# Altium schematic sheet Button.SchDoc
size A4; Author: Đỗ Ngọc Quý; Organization: Altium Limited; Address1: L3, 12a Rodborough Rd; Address2: Frenchs Forest; Address3: NSW; Address4: Australia 2086
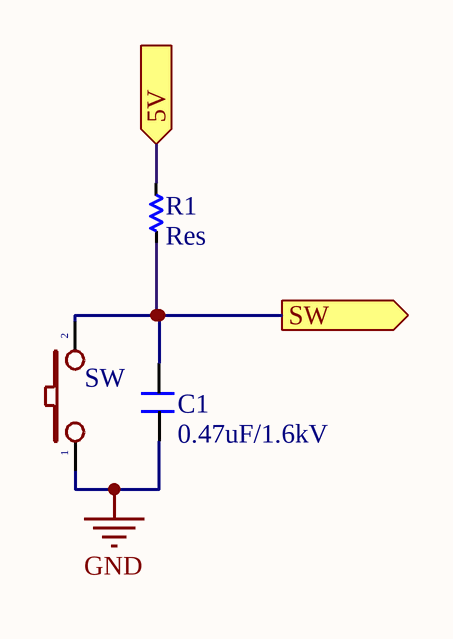
[diagram p0: Button.SchDoc]

## Parts
C1  0.47uF/1.6kV  [cap 0805]
R1  Res  [RES-SMD-0101]
  SW  [SW-SMD_apes]

## Ports
5V (in), SW (out)

## Nets
GND: C1.1 .1
5V: R1.1 ; port 5V
SW: C1.2 R1.2 .2 ; port SW

## Notes on the sheet
- Title
- Size:
- Date:
- A4
- Number:
- Time:
- Revision:
- Sheet
- of
- Author:
- File:

## Library data of the parts
C1 = Cap
R1 = Res-SMD: Resistor; Manufacturer: Generic Components; Class: Passive; Published: 08/06/2000; Publisher: Altium Hobart Technology Centre
 = SW2: Switch button 2 pin; Value: SW chip 2 pin